# EAGLE design RPi Rover Hat (EAGLE 9.5.1)
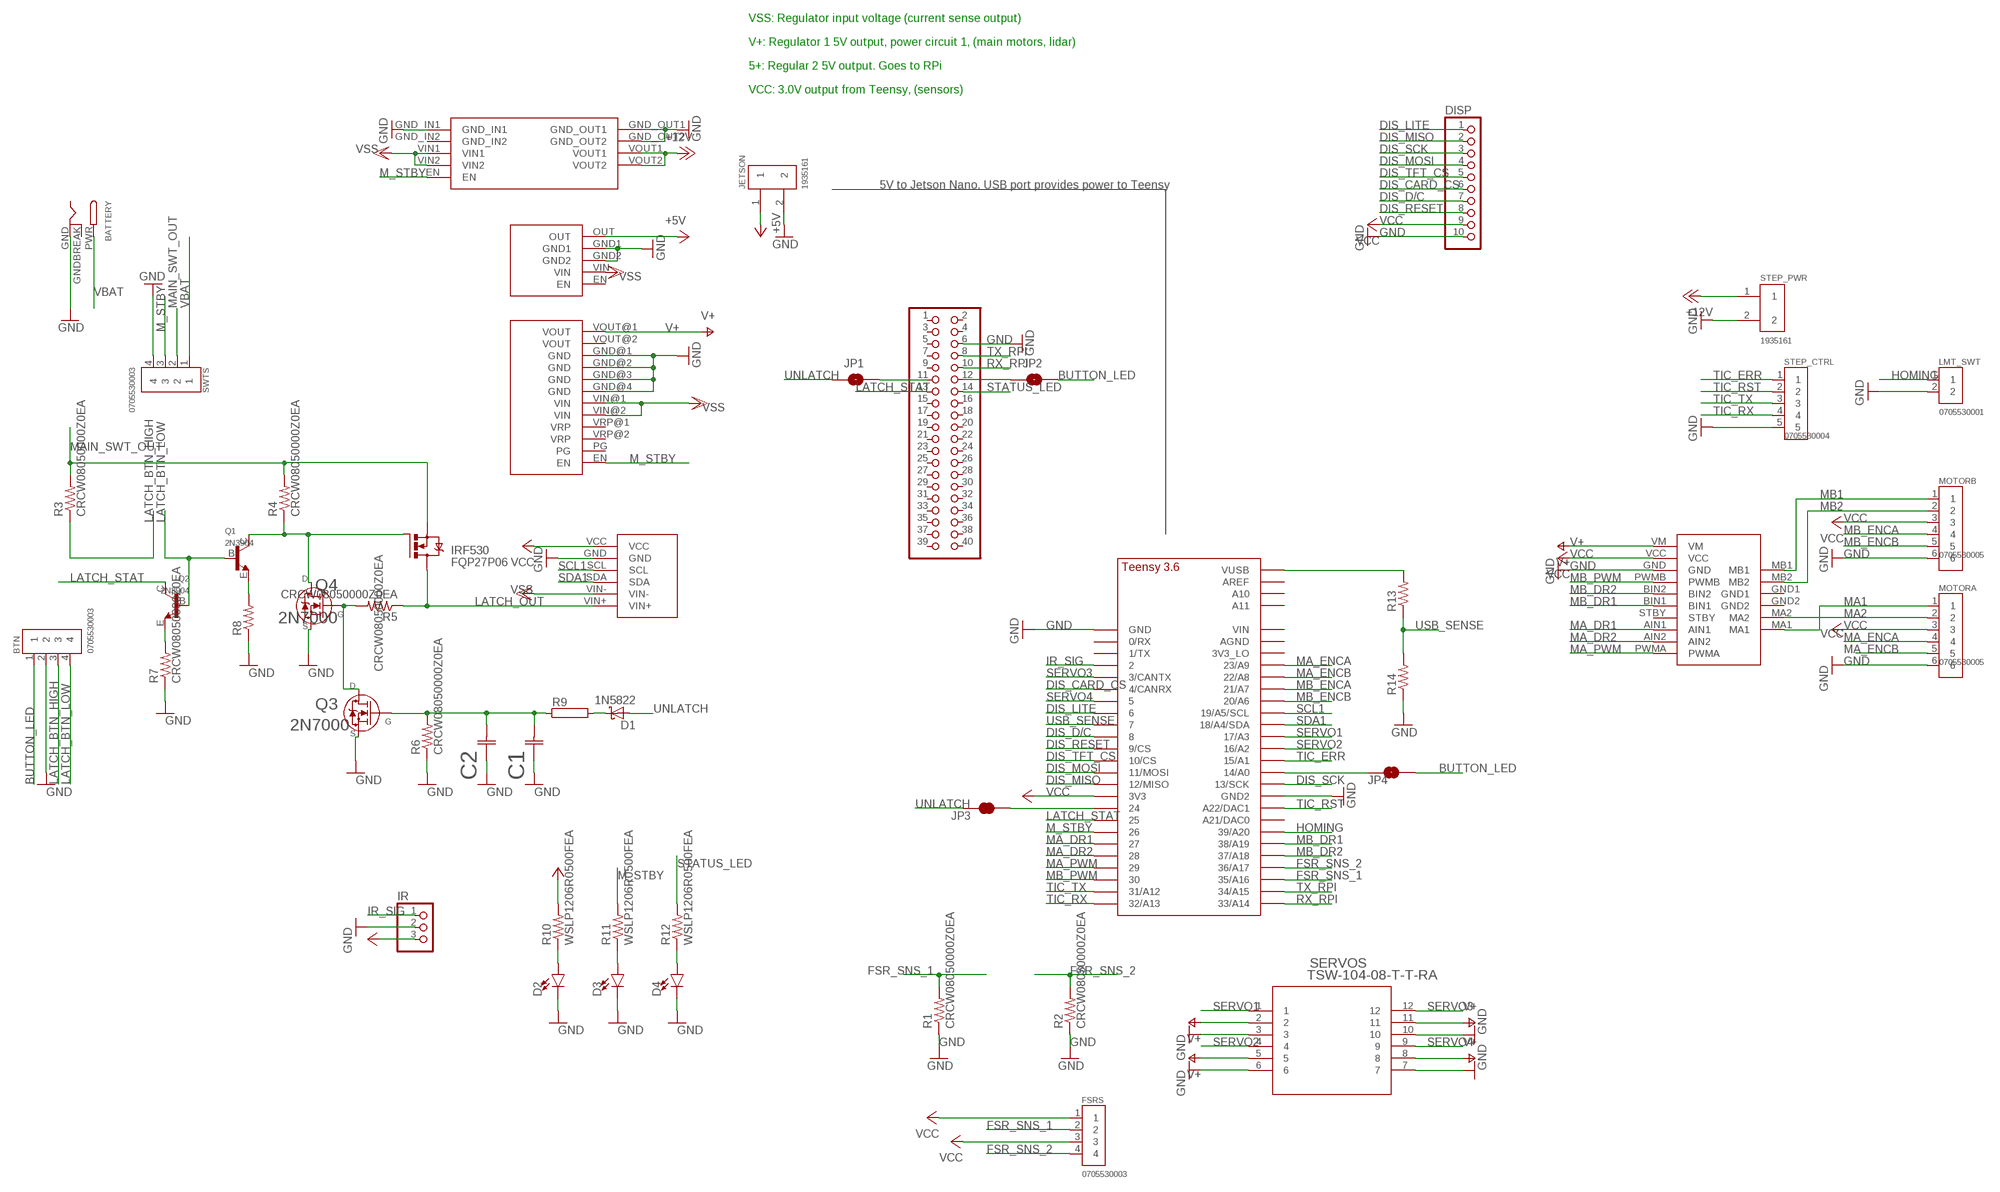
[diagram p0: schematic, sheet 1]

## Parts
BATTERY  DCBARRELPTH  [DCJACK_2MM_PTH]
BTN  0705530003  [MOLEX_0705530003]
C1  FK24X5R0J226M  [CAP_R4525B]
C2  FK24X5R0J226M  [CAP_R4525B]
D1  1N5822  [DIOAD2120W130L950D530P]
D2  LED1206  [LED-1206]
D3  LED1206  [LED-1206]
D4  LED1206  [LED-1206]
DISP  PINHD-1X10  [1X10]
FQP27P06  IRF530  [TO220BV]
FSRS  0705530003  [MOLEX_0705530003]
IR  PINHD-1X3  [1X03]
JETSON  1935161  [PHOENIX_1935161]
JP1  JUMPER-SMT_2_NO_NO-SILK  [SMT-JUMPER_2_NO_NO-SILK]
JP2  JUMPER-SMT_2_NO_NO-SILK  [SMT-JUMPER_2_NO_NO-SILK]
JP3  JUMPER-SMT_2_NC_TRACE_NO-SILK  [SMT-JUMPER_2_NC_TRACE_NO-SILK]
JP4  JUMPER-SMT_2_NC_TRACE_NO-SILK  [SMT-JUMPER_2_NC_TRACE_NO-SILK]
LMT_SWT  0705530001  [MOLEX_0705530001]
MAIN_HEADER  PINHD-2X20  [2X20]
MOTORA  0705530005  [MOLEX_0705530005]
MOTORB  0705530005  [MOLEX_0705530005]
Q1  2N3904  [TO92]
Q2  2N3904  [TO92]
Q3  2N7000  [TO-92]
Q4  2N7000  [TO-92]
R1  CRCW08050000Z0EA  [RES_0805]
R2  CRCW08050000Z0EA  [RES_0805]
R3  CRCW08050000Z0EA  [RES_0805]
R4  CRCW08050000Z0EA  [RES_0805]
R5  CRCW08050000Z0EA  [RES_0805]
R6  CRCW08050000Z0EA  [RES_0805]
R7  CRCW08050000Z0EA  [RES_0805]
R8  CRCW08050000Z0EA  [RES_0805]
R9  RHPS58  [HPS58]
R10  WSLP1206R0500FEA  [RES_1206]
R11  WSLP1206R0500FEA  [RES_1206]
R12  WSLP1206R0500FEA  [RES_1206]
R13  CRCW08050000Z0EA  [RES_0805]
R14  CRCW08050000Z0EA  [RES_0805]
SERVOS  TSW-104-08-T-T-RA  [TSW-104-08-T-T-RA_SAI]
STEP_CTRL  0705530004  [MOLEX_0705530004]
STEP_PWR  1935161  [PHOENIX_1935161]
SWTS  0705530003  [MOLEX_0705530003]
U$1  TEENSY_3.5/3.6_BASIC  [TEENSY_3.5/3.6_BASIC]
U$3  ADAFRUIT_TB6612  [ADAFRUIT_TB6612]
U$4  INA219  [INA219]
U$5  D24V50F5  [D24V50F5]
U$6  S18V20FX  [S18V20FX]
U$7  D36V50FX  [D36V50FX]

## Nets
+5V: JETSON.1 U$5.OUT
+12V: STEP_PWR.1 U$6.VOUT1 U$6.VOUT2
BUTTON_LED: BTN.1 JP2.2 JP4.2
DIS_CARD_CS: DISP.6 U$1.4/CANRX
DIS_D/C: DISP.7 U$1.8
DIS_LITE: DISP.1 U$1.6
DIS_MISO: DISP.2 U$1.12/MISO
DIS_MOSI: DISP.4 U$1.11/MOSI
DIS_RESET: DISP.8 U$1.9/CS
DIS_SCK: DISP.3 U$1.13/SCK
DIS_TFT_CS: DISP.5 U$1.10/CS
FSR_SNS_1: FSRS.2 R1.2 U$1.35/A16
FSR_SNS_2: FSRS.4 R2.2 U$1.36/A17
GND [ground]: BATTERY.GND BTN.2 C1.1 C2.1 D2.C D3.C D4.C DISP.10 IR.2 JETSON.2 LMT_SWT.2 MAIN_HEADER.6 MOTORA.6 MOTORB.6 Q3.1 Q4.1 R1.1 R2.1 R6.1 R7.1 R8.1 R14.1 SERVOS.3 SERVOS.6 SERVOS.7 SERVOS.10 STEP_CTRL.5 STEP_PWR.2 SWTS.4 U$1.GND U$1.GND2 U$3.GND U$4.GND U$5.GND1 U$5.GND2 U$6.GND_IN1 U$6.GND_OUT1 U$6.GND_OUT2 U$7.GND@1(GND) U$7.GND@2(GND) U$7.GND@3(GND) U$7.GND@4(GND)
HOMING: LMT_SWT.1 U$1.39/A20
IR_SIG: IR.1 U$1.2
LATCH_BTN_HIGH: BTN.3 R3.1
LATCH_BTN_LOW: BTN.4 Q1.B Q2.B
LATCH_OUT: FQP27P06.D R5.1 U$4.VIN+
LATCH_STAT: MAIN_HEADER.13 Q2.C U$1.25
M_STBY: R11.2 SWTS.3 U$1.26 U$6.EN U$7.EN
MA1 [power]: MOTORA.1 U$3.MA1
MA2: MOTORA.2 U$3.MA2
MA_DR1: U$1.27 U$3.AIN1
MA_DR2: U$1.28 U$3.AIN2
MA_ENCA: MOTORA.4 U$1.23/A9
MA_ENCB: MOTORA.5 U$1.22/A8
MA_PWM: U$1.29 U$3.PWMA
MAIN_SWT_OUT: FQP27P06.S R3.2 R4.2 SWTS.2
MB1 [power]: MOTORB.1 U$3.MB1
MB2: MOTORB.2 U$3.MB2
MB_DR1: U$1.38/A19 U$3.BIN1
MB_DR2: U$1.37/A18 U$3.BIN2
MB_ENCA: MOTORB.4 U$1.21/A7
MB_ENCB: MOTORB.5 U$1.20/A6
MB_PWM: U$1.30 U$3.PWMB
N$2: D2.A R10.1
N$3: D3.A R11.1
N$4: D4.A R12.1
N$5: JP1.2 MAIN_HEADER.11
N$6: Q2.E R7.2
N$7: Q1.E R8.2
N$8: FQP27P06.G Q1.C Q4.3 R4.1
N$9: Q3.3 Q4.2 R5.2
N$10: D1.C R9.2
N$11: C1.2 C2.2 Q3.2 R6.2 R9.1
N$12: JP4.1 U$1.14/A0
N$13: JP3.2 U$1.24
N$14: R13.2 U$1.VUSB
N$15: JP2.1 MAIN_HEADER.12
RX_RPI: MAIN_HEADER.10 U$1.33/A14
SCL1: U$1.19/A5/SCL U$4.SCL
SDA1: U$1.18/A4/SDA U$4.SDA
SERVO1: SERVOS.1 U$1.17/A3
SERVO2: SERVOS.4 U$1.16/A2
SERVO3: SERVOS.12 U$1.3/CANTX
SERVO4: SERVOS.9 U$1.5
STATUS_LED: MAIN_HEADER.14 R12.2
TIC_ERR: STEP_CTRL.1 U$1.15/A1
TIC_RST: STEP_CTRL.2 U$1.A22/DAC1
TIC_RX: STEP_CTRL.4 U$1.32/A13
TIC_TX: STEP_CTRL.3 U$1.31/A12
TX_RPI: MAIN_HEADER.8 U$1.34/A15
UNLATCH: D1.A JP1.1 JP3.1
USB_SENSE: R13.1 R14.2 U$1.7
V+: SERVOS.2 SERVOS.5 SERVOS.8 SERVOS.11 U$3.VM U$7.VOUT@1(VOUT)
VBAT [power]: BATTERY.PWR SWTS.1
VCC: DISP.9 FSRS.1 FSRS.3 IR.3 MOTORA.3 MOTORB.3 R10.2 U$1.3V3 U$3.VCC U$4.VCC
VSS [power]: U$4.VIN- U$5.VIN U$6.VIN1 U$6.VIN2 U$7.VIN@1(VIN) U$7.VIN@2(VIN)
Unconnected: MAIN_HEADER.1 MAIN_HEADER.2 MAIN_HEADER.3 MAIN_HEADER.4 MAIN_HEADER.5 MAIN_HEADER.7 MAIN_HEADER.9 MAIN_HEADER.15 MAIN_HEADER.16 MAIN_HEADER.17 MAIN_HEADER.18 MAIN_HEADER.19 MAIN_HEADER.20 MAIN_HEADER.21 MAIN_HEADER.22 MAIN_HEADER.23 MAIN_HEADER.24 MAIN_HEADER.25 MAIN_HEADER.26 MAIN_HEADER.27 MAIN_HEADER.28 MAIN_HEADER.29 MAIN_HEADER.30 MAIN_HEADER.31 MAIN_HEADER.32 MAIN_HEADER.33 MAIN_HEADER.34 MAIN_HEADER.35 MAIN_HEADER.36 MAIN_HEADER.37 MAIN_HEADER.38 MAIN_HEADER.39 MAIN_HEADER.40 U$1.0/RX U$1.1/TX U$1.3V3_LO U$1.21/DAC0(A21/DAC0) U$1.A10 U$1.A11 U$1.AGND U$1.AREF U$1.VIN U$3.GND1 U$3.GND2 U$3.STBY U$5.EN U$6.GND_IN2 U$7.PG U$7.VOUT@2(VOUT) U$7.VRP@1(VRP) U$7.VRP@2(VRP)

## Notes on the sheet
- VSS: Regulator input voltage (current sense output)
- V+: Regulator 1 5V output, power circuit 1, (main motors, lidar)
- 5+: Regular 2 5V output. Goes to RPi
- VCC: 3.0V output from Teensy, (sensors)
- 5V to Jetson Nano. USB port provides power to Teensy

## Power pins joined to a net without a drawn wire
GNDBREAK: BATTERY.GNDBREAK

## Library data of the parts
BATTERY = adafruit:DCBARREL: 2.0mm DC Barrel Jack DCJACK_2MM_PTH - Through Hole Jack (4UConnector: 05537)
BTN FSRS SWTS = Molex Right Angle 4 position 0705530003:0705530003: Conn Shrouded Header HDR 4 POS 2.54mm Solder RA Thru-Hole; DESCRIPTION: Connector Header Through Hole, Right Angle 4 position 0.100 (2.54mm); DIGI-KEY_PART_NUMBER: WM4902-ND; MF: Molex; MP: 0705530003; PACKAGE: None
C1 C2 = FK24X5R0J226M:FK24X5R0J226M; BUILT_BY: EMA_UL_Team; MANUFACTURER_PART_NUMBER: FK24X5R0J226M; VENDOR: TDK
D1 = 1N5822:1N5822: 1N5822 Series 40 V 3 A Through Hole Schottky Rectifier - DO-201AD; DIGI-KEY_PART_NUMBER: 1N5822FSCT-ND; DIGI-KEY_PURCHASE_URL: https://www.digikey.com/product-detail/en/on-semiconductor/1N5822/1N5822FSCT-ND/3042493?utm_source=snapeda&utm_medium=aggregator&utm_campaign=symbol; MF: ON Semiconductor; MP: 1N5822; PACKAGE: DO-201AD-201 CDIL
D2-D4 = SparkFun-LED:LED: LED (Generic) Standard schematic elements and footprints for 5mm, 3mm, 1206, and 0603 sized LEDs. Generic LEDs with no color specified.
DISP = pinhead:PINHD-1X10: PIN HEADER
FQP27P06 = IRF530:IRF530: HEXFET Power MOSFET; AVAILABILITY: Unavailable; MF: Vishay Siliconix; MP: IRF530; PACKAGE: TO-220-3 Samsung; PRICE: None
IR = pinhead:PINHD-1X3: PIN HEADER
JETSON STEP_PWR = 1935161:1935161: Conn Terminal Blocks 2 POS 5mm Solder ST Thru-Hole 16A; DESCRIPTION: Conn Terminal Blocks 2 POS 5mm Solder ST Thru-Hole 16A; DIGI-KEY_PART_NUMBER: 277-1667-ND; DIGI-KEY_PURCHASE_URL: https://www.digikey.com/product-detail/en/phoenix-contact/1935161/277-1667-ND/568614?utm_source=snapeda&utm_medium=aggregator&utm_campaign=symbol; MF: Phoenix Contact; MP: 1935161; PACKAGE: None
JP1 JP2 = SparkFun-Jumpers:JUMPER-SMT_2_NO: Normally open jumper This jumper has two pads in close proximity to each other. Apply solder to close the connection. Round pads are easier to solder for beginners, but are a lot larger. SparkFun Product that uses the round pads: SparkFun EL Sequencer <https://www.sparkfun.com/products/12781>
JP3 JP4 = SparkFun-Jumpers:JUMPER-SMT_2_NC_TRACE: Normally closed trace jumper This jumper has a trace between two pads so it's normally closed (NC). Use a razor knife to open the connection. For best results follow the IPC guidelines for cutting traces: Cutout at least 0.063 mm (0.005 in). Remove all loose material to clean up the cut area. Seal the cut with an approved epoxy. Reapply solder to reclose the connection.
LMT_SWT = Molex Right Angle 4 position 0705530003:0705530001
MAIN_HEADER = adafruit:PINHD-2X20: PIN HEADER
MOTORA MOTORB = Molex Right Angle 4 position 0705530003:0705530005
Q1 Q2 = 2N3904:2N3904
Q3 Q4 = 2N7000:2N7000; BUILT_BY: EMA_UL_Team; MANUFACTURER_PART_NUMBER: 2N7000; VENDOR: STMicroelectronics
R1-R8 R13 R14 = Resistor_Capacitor:CRCW08050000Z0EA: RES SMD 0 OHM JUMPER 1/8W 0805 Manufacturer's datasheet <http://www.vishay.com/docs/20035/dcrcwe3.pdf>; CREATED_BY: PCBLayout.com; DIGIKEY_PART_NUMBER: 541-0.0ATR-ND; MANUFACTURER: Vishay Dale; MPN: CRCW08050000Z0EA; PACKAGE: SMD 0805
R9 = resistor-power:R: Power Resitor; OC_FARNELL: unknown; OC_NEWARK: unknown
R10-R12 = Resistor_Capacitor:WSLP1206R0500FEA: RES 0.05 OHM 1% 1W 1206 Manufacturer's datasheet <http://www.vishay.com/docs/30122/wslp.pdf>; CREATED_BY: PCBLayout.com; DIGIKEY_PART_NUMBER: WSLP-.05TR-ND; MANUFACTURER: Vishay Dale; MPN: WSLP1206R0500FEA; PACKAGE: SMD 1206
SERVOS = 4X3 Header Pin:TSW-104-08-T-T-RA; BUILT_BY: EMA_UL_Team; MANUFACTURER_PART_NUMBER: TSW-104-08-T-T-RA; SOURCELIBRARY: Samtec_2016-10-07_8; VENDOR: Samtec Inc
STEP_CTRL = Molex Right Angle 4 position 0705530003:0705530004
U$1 = Teensy356:TEENSY_3.5/3.6_BASIC
U$3 = adafruit_TB6612:ADAFRUIT_TB6612
U$4 = adafruit_INA219:INA219
U$5 = D24V50F5:D24V50F5
U$6 = S18V20FX:S18V20FX
U$7 = D36V50Fx:D36V50FX

## Net classes
0 default: drill 0.203 mm, clearance 0.102 mm
1 power: width 0.406 mm, drill 0.203 mm, clearance 0.102 mm
2 ground: width 0.406 mm, drill 0.203 mm, clearance 0.102 mm

## Board
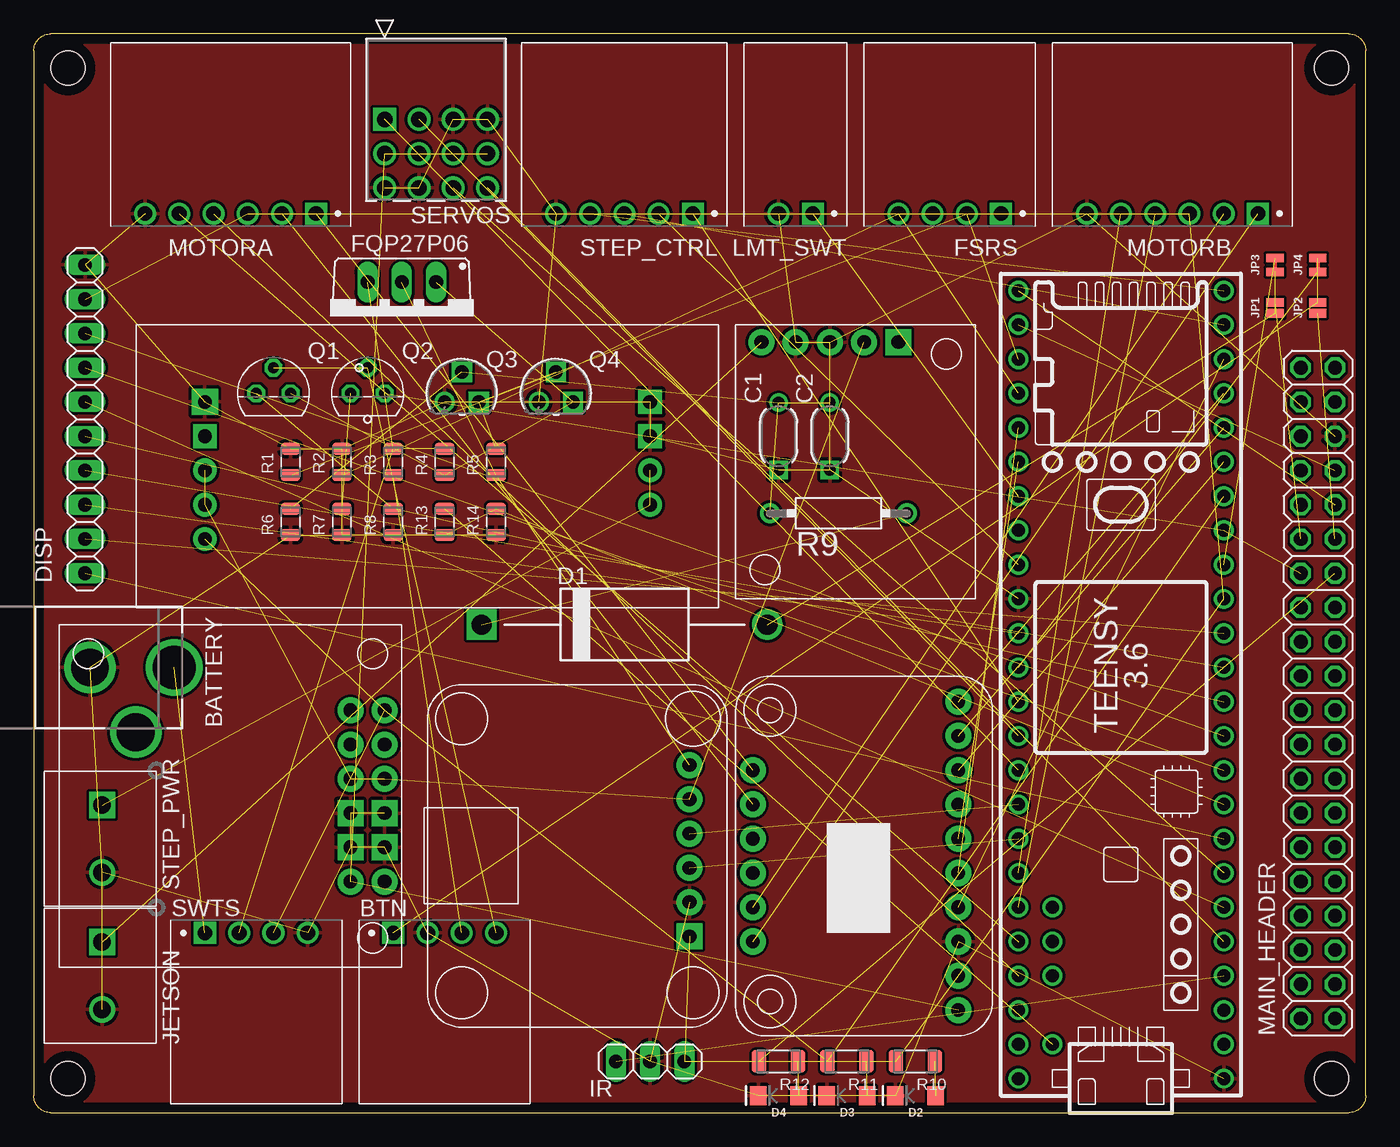
[diagram p1: board, top side]
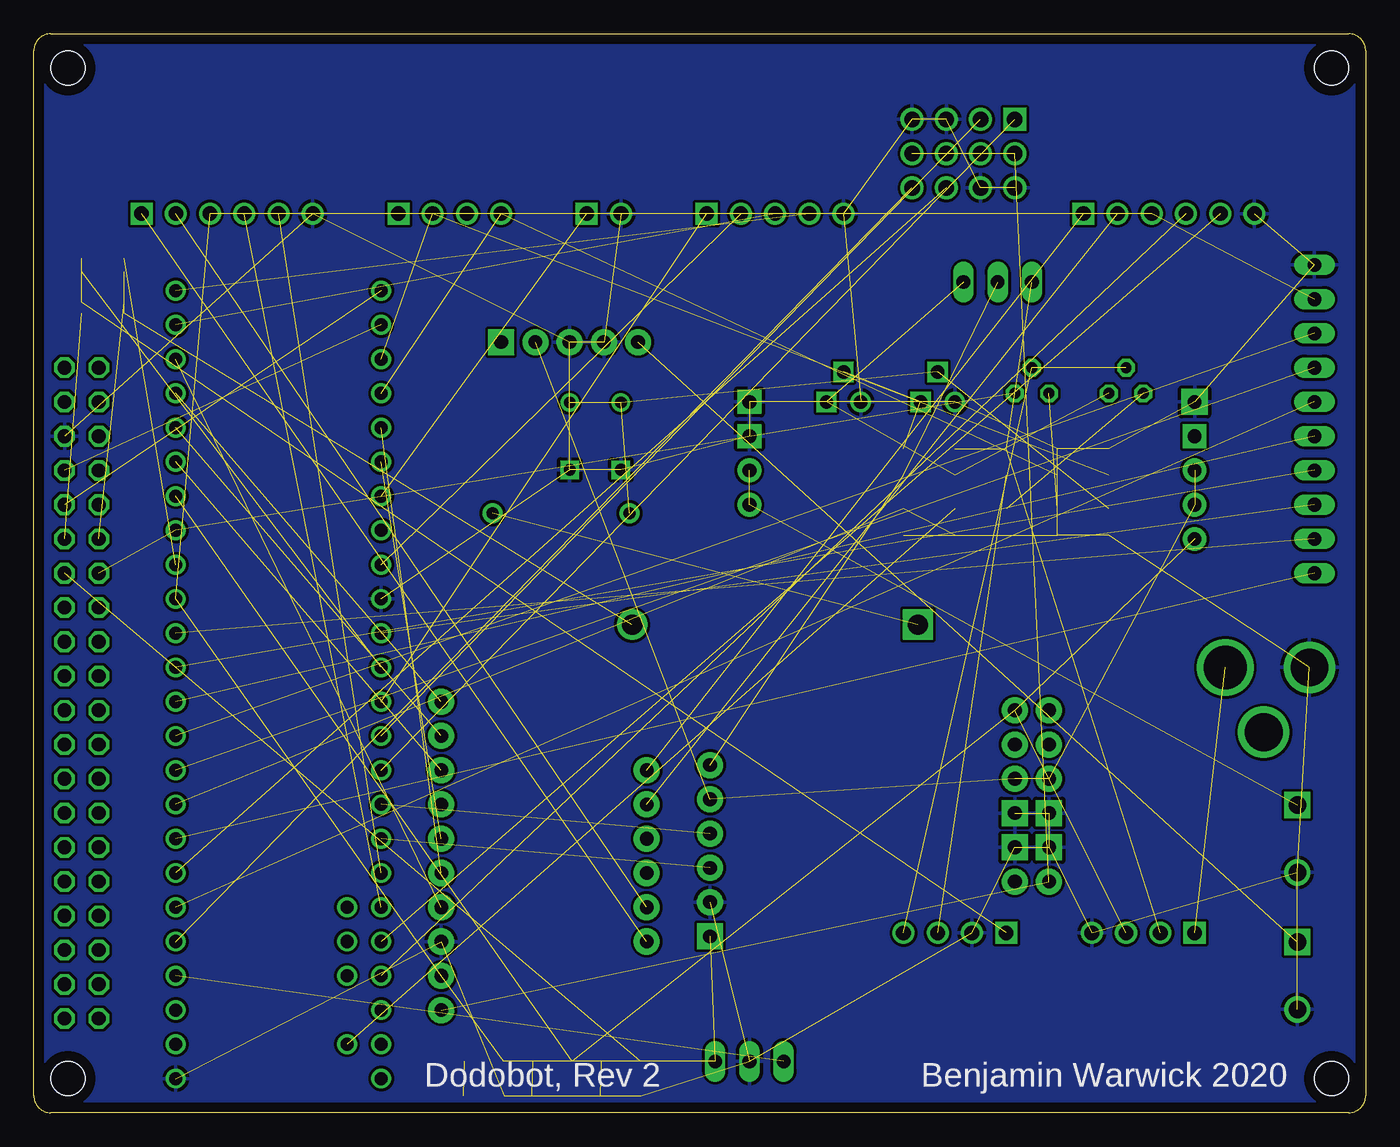
[diagram p2: board, bottom side, seen from below]

Size 98.81 x 80.01 mm. Coordinates in mm from the lower left corner, seen from the top.
Outline: 1.27,0 97.54,0 arc90 98.81,1.27 98.81,78.74 arc90 97.54,80.01 1.27,80.01 arc90 0,78.74 0,1.27 arc90 1.27,0
Copper layers (1*16): Top 0.035mm / dielectric 1.5mm / Bottom 0.035mm
Design rules "default *": minimum track width 16mil, minimum drill 0.35mm, track to track 8mil, track to pad 8mil, pad to pad 8mil, via to via 8mil, smd to smd 6mil, copper to edge 30mil, drill to drill 6mil, minimum pad ring 10mil, minimum via ring 8mil, stop-mask expansion 4mil, vias tented up to drill 0mil, thermal gap 10mil
Holes 2.54 mm at 2.54,77.47 96.27,77.47 2.54,2.54 96.27,2.54

### Footprints (pad centres in the part's own frame; a part is rotated, then mirrored left to right if it is on the bottom)
DCJACK_2MM_PTH = drill 2.8: GND 0,7.35; GNDBREAK 4.8,10.75 | drill 3.2: PWR 0,13.6
MOLEX_0705530003 = drill 1.09 square: 1 0,0 | drill 1.09: 2 2.54,0; 3 5.08,0; 4 7.62,0
CAP_R4525B = drill 0.864 pad 1.372 square: 1 -2.489,0 | drill 0.864 pad 1.372: 2 2.489,0
DIOAD2120W130L950D530P = drill 1.5 pad 2.25: A 10.6,0 | drill 1.5 pad 2.25 square: C -10.6,0
LED-1206 = smd 1.2 x 1.4: A -1.5,0; C 1.5,0
1X10 = drill 1.016 long: 1 -11.43,0; 2 -8.89,0; 3 -6.35,0; 4 -3.81,0; 5 -1.27,0; 6 1.27,0; 7 3.81,0; 8 6.35,0; 9 8.89,0; 10 11.43,0
TO220BV = drill 1.016 long: D 0,-2.54; G -2.54,-2.54; S 2.54,-2.54
1X03 = drill 1.016 long: 1 -2.54,0; 2 0,0; 3 2.54,0
PHOENIX_1935161 = drill 1.3 square: 1 -2.5,0 | drill 1.3: 2 2.5,0
SMT-JUMPER_2_NO_NO-SILK = smd 0.635 x 1.27: 1 -0.406,0; 2 0.406,0
SMT-JUMPER_2_NC_TRACE_NO-SILK = smd 0.635 x 1.27: 1 -0.508,0; 2 0.508,0
MOLEX_0705530001 = drill 1.09 square: 1 0,0 | drill 1.09: 2 2.54,0
2X20 = drill 1.016 octagon: 1 -24.13,-1.27; 2 -24.13,1.27; 3 -21.59,-1.27; 4 -21.59,1.27; 5 -19.05,-1.27; 6 -19.05,1.27; 7 -16.51,-1.27; 8 -16.51,1.27; 9 -13.97,-1.27; 10 -13.97,1.27; 11 -11.43,-1.27; 12 -11.43,1.27; 13 -8.89,-1.27; 14 -8.89,1.27; 15 -6.35,-1.27; 16 -6.35,1.27; 17 -3.81,-1.27; 18 -3.81,1.27; 19 -1.27,-1.27; 20 -1.27,1.27; 21 1.27,-1.27; 22 1.27,1.27; 23 3.81,-1.27; 24 3.81,1.27; 25 6.35,-1.27; 26 6.35,1.27; 27 8.89,-1.27; 28 8.89,1.27; 29 11.43,-1.27; 30 11.43,1.27; 31 13.97,-1.27; 32 13.97,1.27; 33 16.51,-1.27; 34 16.51,1.27; 35 19.05,-1.27; 36 19.05,1.27; 37 21.59,-1.27; 38 21.59,1.27; 39 24.13,-1.27; 40 24.13,1.27
MOLEX_0705530005 = drill 1.09 square: 1 0,0 | drill 1.09: 2 2.54,0; 3 5.08,0; 4 7.62,0; 5 10.16,0; 6 12.7,0
TO92 = drill 0.813 octagon: B 0,1.905; C 1.27,0; E -1.27,0
TO-92 = drill 0.991 pad 1.499: 1 -2.54,-1.905 | drill 0.991 pad 1.499 square: 2 -1.27,0.318; 3 0,-1.905
RES_0805 = smd 0.87 x 1.42: 1 -0.975,0; 2 0.975,0
HPS58 = drill 0.9 pad 1.5: 1 -5.08,0; 2 5.08,0
RES_1206 = smd 1.08 x 1.68: 1 -1.445,0; 2 1.445,0
TSW-104-08-T-T-RA_SAI = drill 1.143 pad 1.651 square: 1 0,0 | drill 1.143 pad 1.651: 2 0,-2.54; 3 0,-5.08; 4 2.54,0; 5 2.54,-2.54; 6 2.54,-5.08; 7 5.08,0; 8 5.08,-2.54; 9 5.08,-5.08; 10 7.62,0; 11 7.62,-2.54; 12 7.62,-5.08
MOLEX_0705530004 = drill 1.09 square: 1 0,0 | drill 1.09: 2 2.54,0; 3 5.08,0; 4 7.62,0; 5 10.16,0
TEENSY_3.5/3.6_BASIC = drill 0.965: 0/RX -25.4,-7.62; 1/TX -22.86,-7.62; 2 -20.32,-7.62; 3/CANTX -17.78,-7.62; 3V3 7.62,-7.62; 3V3_LO -22.86,7.62; 4/CANRX -15.24,-7.62; 5 -12.7,-7.62; 6 -10.16,-7.62; 7 -7.62,-7.62; 8 -5.08,-7.62; 9/CS -2.54,-7.62; 10/CS 0,-7.62; 11/MOSI 2.54,-7.62; 12/MISO 5.08,-7.62; 13/SCK 5.08,7.62; 14/A0 2.54,7.62; 15/A1 0,7.62; 16/A2 -2.54,7.62; 17/A3 -5.08,7.62; 18/A4/SDA -7.62,7.62; 19/A5/SCL -10.16,7.62; 20/A6 -12.7,7.62; 21/A7 -15.24,7.62; 21/DAC0 12.7,7.62; 22/A8 -17.78,7.62; 23/A9 -20.32,7.62; 24 10.16,-7.62; 25 12.7,-7.62; 26 15.24,-7.62; 27 17.78,-7.62; 28 20.32,-7.62; 29 22.86,-7.62; 30 25.4,-7.62; 31/A12 27.94,-7.62; 32/A13 30.48,-7.62; 33/A14 30.48,7.62; 34/A15 27.94,7.62; 35/A16 25.4,7.62; 36/A17 22.86,7.62; 37/A18 20.32,7.62; 38/A19 17.78,7.62; 39/A20 15.24,7.62; A10 -17.78,5.08; A11 -15.24,5.08; A22/DAC1 10.16,7.62; AGND -25.4,7.62; AREF -20.32,5.08; GND -27.94,-7.62; GND2 7.62,7.62; VIN -27.94,7.62; VUSB -25.4,5.08
ADAFRUIT_TB6612 = drill 1.016 pad 1.93: AIN1 2.54,6.985; AIN2 2.54,4.445; BIN1 2.54,12.065; BIN2 2.54,14.605; GND 2.54,19.685; GND1 17.78,14.605; GND2 17.78,12.065; MA1 17.78,6.985; MA2 17.78,9.525; MB1 17.78,19.685; MB2 17.78,17.145; PWMA 2.54,1.905; PWMB 2.54,17.145; STBY 2.54,9.525; VCC 2.54,22.225; VM 2.54,24.765
INA219 = drill 1.016 pad 1.93: GND 9.271,2.794; SCL 11.811,2.794; SDA 14.351,2.794; VIN+ 19.431,2.794; VIN- 16.891,2.794 | drill 1.016 pad 1.93 square: VCC 6.731,2.794
D24V50F5 = drill 1.016 pad 1.93 square: EN 5.715,1.27 | drill 1.016 pad 1.93: GND1 10.795,1.27; GND2 13.335,1.27; OUT 15.875,1.27; VIN 8.255,1.27
S18V20FX = drill 1.016 pad 1.778: EN 5.08,5.08; VIN1 5.08,10.16; VIN2 5.08,7.62; VOUT1 38.1,10.16; VOUT2 38.1,7.62 | drill 1.016 pad 1.93 square: GND_IN1 5.08,15.24 | drill 1.016 pad 1.778 square: GND_IN2 5.08,12.7; GND_OUT1 38.1,15.24; GND_OUT2 38.1,12.7
D36V50FX = drill 1.016 pad 1.93: EN 19.05,1.27; PG 19.05,3.81; VIN@1 13.97,3.81; VIN@2 13.97,1.27; VOUT@1 6.35,3.81; VOUT@2 6.35,1.27; VRP@1 16.51,3.81; VRP@2 16.51,1.27 | drill 1.016 pad 1.93 square: GND@1 8.89,3.81; GND@2 8.89,1.27; GND@3 11.43,3.81; GND@4 11.43,1.27

### Placement (x,y rotation side)
BATTERY  -3.17,33.02 270 top
BTN  26.67,13.34 0 top
C1  55.24,50.16 90 top
C2  59.05,50.16 90 top
D1  43.81,36.2 0 top
D2  65.41,1.27 180 top
D3  60.33,1.27 180 top
D4  55.24,1.27 180 top
DISP  3.81,51.44 90 top
FQP27P06  27.3,59.05 180 top
FSRS  71.75,66.67 180 top
IR  45.72,3.81 0 top
JETSON  5.08,10.16 270 top
JP1  92.08,59.69 90 top
JP2  95.25,59.69 90 top
JP3  92.08,62.87 90 top
JP4  95.25,62.87 90 top
LMT_SWT  57.78,66.67 180 top
MAIN_HEADER  95.25,31.11 270 top
MOTORA  20.95,66.67 180 top
MOTORB  90.81,66.67 180 top
Q1  17.78,53.34 0 top
Q2  24.77,53.34 0 top
Q3  33.02,54.61 0 top
Q4  40.01,54.61 0 top
R1  19.05,48.26 270 top
R2  22.86,48.26 270 top
R3  26.67,48.26 90 top
R4  30.48,48.26 90 top
R5  34.29,48.26 90 top
R6  19.05,43.81 90 top
R7  22.86,43.81 90 top
R8  26.67,43.81 90 top
R9  59.69,44.45 0 top
R10  65.41,3.81 180 top
R11  60.33,3.81 180 top
R12  55.24,3.81 180 top
R13  30.48,43.81 90 top
R14  34.29,43.81 90 top
SERVOS  26.04,73.66 0 top
STEP_CTRL  48.9,66.67 180 top
STEP_PWR  5.08,20.32 270 top
SWTS  12.7,13.34 0 top
U$1  80.64,30.48 90 top
U$3  71.12,32.38 180 top
U$4  51.44,6.35 90 top
U$5  69.85,58.42 180 top
U$6  7.62,37.47 0 top
U$7  27.3,10.79 90 top

### Tracks (layer width: path | path; a pad name or v marks a point on that pad's centre or on a via)
+5V  (1 unrouted)
+12V  (2 unrouted)
BUTTON_LED  (2 unrouted)
DIS_CARD_CS  (1 unrouted)
DIS_D/C  (1 unrouted)
DIS_LITE  (1 unrouted)
DIS_MISO  (1 unrouted)
DIS_MOSI  (1 unrouted)
DIS_RESET  (1 unrouted)
DIS_SCK  (1 unrouted)
DIS_TFT_CS  (1 unrouted)
FSR_SNS_1  (2 unrouted)
FSR_SNS_2  (2 unrouted)
GND  (41 unrouted)
  pour Top: 0,0 0,80.01 99.06,80.01 99.06,0
  pour Bottom: 0,0 0,80.01 99.06,80.01 99.06,0
HOMING  (1 unrouted)
IR_SIG  (1 unrouted)
LATCH_BTN_HIGH  (1 unrouted)
LATCH_BTN_LOW  (2 unrouted)
LATCH_OUT  (2 unrouted)
LATCH_STAT  (2 unrouted)
M_STBY  (4 unrouted)
MA1  (1 unrouted)
MA2  (1 unrouted)
MA_DR1  (1 unrouted)
MA_DR2  (1 unrouted)
MA_ENCA  (1 unrouted)
MA_ENCB  (1 unrouted)
MA_PWM  (1 unrouted)
MAIN_SWT_OUT  (3 unrouted)
MB1  (1 unrouted)
MB2  (1 unrouted)
MB_DR1  (1 unrouted)
MB_DR2  (1 unrouted)
MB_ENCA  (1 unrouted)
MB_ENCB  (1 unrouted)
MB_PWM  (1 unrouted)
N$2  (1 unrouted)
N$3  (1 unrouted)
N$4  (1 unrouted)
N$5  (1 unrouted)
N$6  (1 unrouted)
N$7  (1 unrouted)
N$8  (3 unrouted)
N$9  (2 unrouted)
N$10  (1 unrouted)
N$11  (4 unrouted)
N$12  (1 unrouted)
N$13  (1 unrouted)
N$14  (1 unrouted)
N$15  (1 unrouted)
RX_RPI  (1 unrouted)
SCL1  (1 unrouted)
SDA1  (1 unrouted)
SERVO1  (1 unrouted)
SERVO2  (1 unrouted)
SERVO3  (1 unrouted)
SERVO4  (1 unrouted)
STATUS_LED  (1 unrouted)
TIC_ERR  (1 unrouted)
TIC_RST  (1 unrouted)
TIC_RX  (1 unrouted)
TIC_TX  (1 unrouted)
TX_RPI  (1 unrouted)
UNLATCH  (2 unrouted)
USB_SENSE  (2 unrouted)
V+  (5 unrouted)
VBAT  (1 unrouted)
VCC  (9 unrouted)
VSS  (5 unrouted)

### Text on the board
bNames: Benjamin Warwick 2020 | Dodobot, Rev 2